# Altium project Dragonfleye.PrjPcb
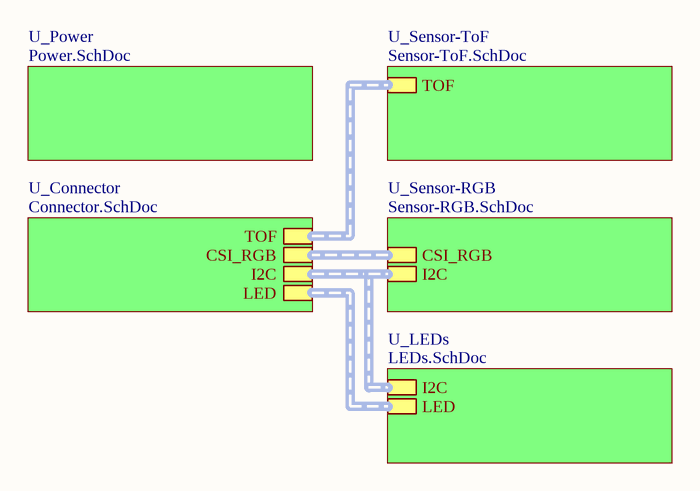
[diagram p0: Dragonfleye.SchDoc]
6 sheets, 63 parts. Net scope: hierarchical (ports join the sheet entries above them; power ports are global).
Board file: Dragonfleye.PcbDoc
Sheets:
  Dragonfleye.SchDoc
    U_Power = Power.SchDoc
    U_LEDs = LEDs.SchDoc
    U_Sensor-ToF = Sensor-ToF.SchDoc
    U_Connector = Connector.SchDoc
    U_Sensor-RGB = Sensor-RGB.SchDoc

## Sheet Dragonfleye.SchDoc
size A; DocumentNumber: 1; SheetNumber: 1

### Sub-sheets
U_Connector = Connector.SchDoc: I2C (harness I2C), TOF (harness TOF), LED (harness LED), CSI_RGB (harness CSI)
U_LEDs = LEDs.SchDoc: LED (harness LED), I2C (harness I2C)
U_Power = Power.SchDoc: no entries
U_Sensor-RGB = Sensor-RGB.SchDoc: CSI_RGB (harness CSI), I2C (harness I2C)
U_Sensor-ToF = Sensor-ToF.SchDoc: TOF (harness TOF)

### Buses and harness runs
harness sheet U_Connector/CSI_RGB = sheet U_Sensor-RGB/CSI_RGB
harness sheet U_Connector/I2C = sheet U_LEDs/I2C = sheet U_Sensor-RGB/I2C
harness sheet U_Connector/LED = sheet U_LEDs/LED
harness sheet U_Connector/TOF = sheet U_Sensor-ToF/TOF

## Sheet Power.SchDoc
size A
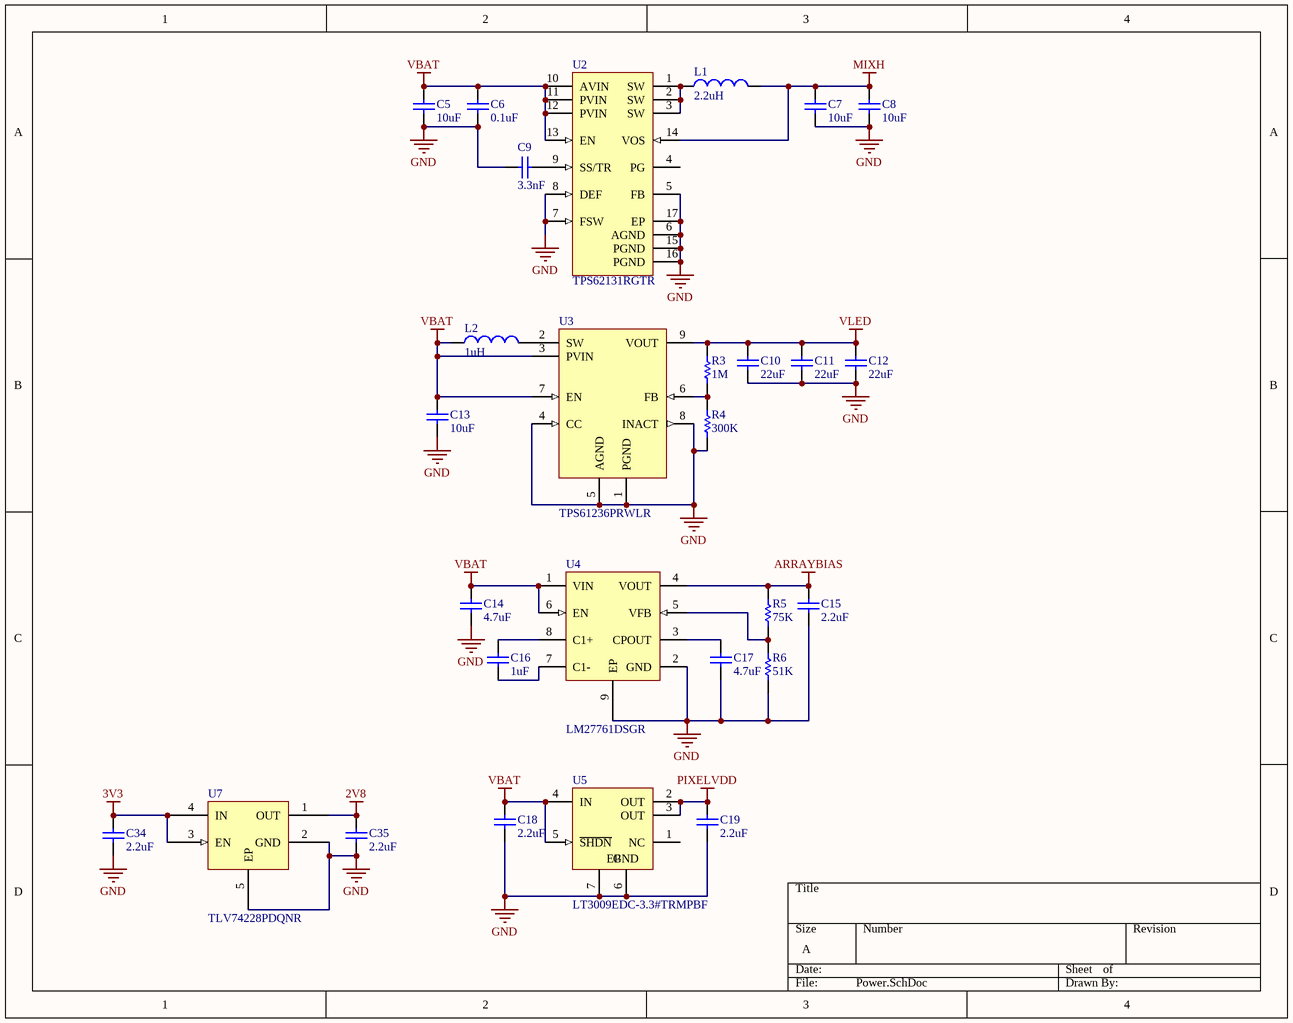
[diagram p1: Power.SchDoc]

### Parts
C5  value 10uF  [C0402[1005X55]]  (hidden comment: 10uF 6.3V 0402)
C6  value 0.1uF  [C0201[0603X30]]  (hidden comment: 0.1uF 6.3V 0201)
C7  value 10uF  [C0402[1005X55]]  (hidden comment: 10uF 6.3V 0402)
C8  value 10uF  [C0402[1005X55]]  (hidden comment: 10uF 6.3V 0402)
C9  value 3.3nF  [C0201[0603X30]]  (hidden comment: 3.3nF 6.3V 0201)
C10  value 22uF  [C0603[1608X92]]  (hidden comment: 22uF 6.3V 0603)
C11  value 22uF  [C0603[1608X92]]  (hidden comment: 22uF 6.3V 0603)
C12  value 22uF  [C0603[1608X92]]  (hidden comment: 22uF 6.3V 0603)
C13  value 10uF  [C0402[1005X55]]  (hidden comment: 10uF 6.3V 0402)
C14  value 4.7uF  [C0402[1005X55]]  (hidden comment: 4.7uF 6.3V 0402)
C15  value 2.2uF  [C0402[1005X55]]  (hidden comment: 2.2uF 6.3V 0402)
C16  value 1uF  [C0402[1005X55]]  (hidden comment: 1uF 6.3V 0402)
C17  value 4.7uF  [C0402[1005X55]]  (hidden comment: 4.7uF 6.3V 0402)
C18  value 2.2uF  [C0402[1005X55]]  (hidden comment: 2.2uF 6.3V 0402)
C19  value 2.2uF  [C0402[1005X55]]  (hidden comment: 2.2uF 6.3V 0402)
C34  value 2.2uF  [C0402[1005X55]]  (hidden comment: 2.2uF 6.3V 0402)
C35  value 2.2uF  [C0402[1005X55]]  (hidden comment: 2.2uF 6.3V 0402)
L1  2.2uH  [IND1008]
L2  1uH  [IND1008]
R3  value 1M  [R0402[1005]]  (hidden comment: 1M 1% 0402)
R4  value 300K  [R0402[1005]]  (hidden comment: 300K 1% 0402)
R5  value 75K  [R0402[1005]]  (hidden comment: 75K 1% 0402)
R6  value 51K  [R0402[1005]]  (hidden comment: 51K 1% 0402)
U2  TPS62131RGTR  [RGT0016C_V]
U3  TPS61236PRWLR  [VQFN-9]
U4  LM27761DSGR  [WSON-8]
U5  LT3009EDC-3.3#TRMPBF  [LT-DC6-6_V]
U7  TLV74228PDQNR  [X2SON-4]

### Nets
2V8: C35.2 U7.1(OUT)
3V3: C34.2 U7.3(EN) U7.4(IN)
ARRAYBIAS: C15.2 R5.2 U4.4(VOUT)
GND: C5.1 C6.1 C7.1 C8.1 C9.1 C10.1 C11.1 C12.1 C13.1 C14.1 C15.1 C17.1 C18.1 C19.1 C34.1 C35.1 R4.1 R6.1 U2.5(FB) U2.6(AGND) U2.7(FSW) U2.8(DEF) U2.15(PGND) U2.16(PGND) U2.17(EP) U3.1(PGND) U3.4(CC) U3.5(AGND) U3.8(INACT) U4.2(GND) U4.9(EP) U5.6(GND) U5.7(EP) U7.2(GND) U7.5(EP)
MIXH: C7.2 C8.2 L1.2 U2.14(VOS)
PIXELVDD: C19.2 U5.2(OUT) U5.3(OUT)
VBAT: C5.2 C6.2 C13.2 C14.2 C18.2 L2.1 U2.10(AVIN) U2.11(PVIN) U2.12(PVIN) U2.13(EN) U3.3(PVIN) U3.7(EN) U4.1(VIN) U4.6(EN) U5.4(IN) U5.5(~{SHDN})
VLED: C10.2 C11.2 C12.2 R3.2 U3.9(VOUT)
NetC9_2: C9.2 U2.9(SS/TR)
NetC16_1: C16.1 U4.7(C1-)
NetC16_2: C16.2 U4.8(C1+)
NetC17_2: C17.2 U4.3(CPOUT)
NetL1_1: L1.1 U2.1(SW) U2.2(SW) U2.3(SW)
NetL2_2: L2.2 U3.2(SW)
NetR3_1: R3.1 R4.2 U3.6(FB)
NetR5_1: R5.1 R6.2 U4.5(VFB)

Not connected (* = marked no-connect by the designer): U2 4(PG); U5 1(NC)

### Library data of the parts
C5 C7 C8 C13 = CAP_10uF_6.3V_0402_20%: 10uF 6.3V 20% 0402 (1005 Metric); PartNumber: GRM155R60J106ME44D; Manufacturer: Murata; Mounting Technology: Surface Mount; PackageReference: 0402; PackageDescription: 0402 (1005 Metric); Voltage: 6.3V; Tolerance: 20%
C6 = CAP_0.1uF_6.3V_0201_10%: 0.1uF 6.3V 10% 0201 (0603 Metric); PartNumber: GRT033R60J104KE01D; Manufacturer: Murata; Mounting Technology: Surface Mount; PackageReference: 0201; PackageDescription: 0201 (0603 Metric); Voltage: 6.3V; Tolerance: 10%
C9 = CAP_3,3nF_6.3V_0201_10%: 3.3nF 6.3V 10% 0201 (0603 Metric); PartNumber: GRM033R70J332KA01D; Manufacturer: Murata; Mounting Technology: Surface Mount; PackageReference: 0201; PackageDescription: 0201 (0603 Metric); Voltage: 6.3V; Tolerance: 10%
C10-C12 = CAP_22uF_6.3V_0603_10%: 22uF 6.3V 10% 0603 (1608 Metric); PartNumber: GRT188R60J226ME13D; Manufacturer: Murata; Mounting Technology: Surface Mount; PackageReference: 0603; PackageDescription: 0603 (1608 Metric); Voltage: 6.3V; Tolerance: 10%
C14 C17 = CAP_4.7uF_6.3V_0402_20%: 4.7uF 6.3V 20% 0402 (1005 Metric); PartNumber: GRM155R60J475ME47D; Manufacturer: Murata; Mounting Technology: Surface Mount; PackageReference: 0402; PackageDescription: 0402 (1005 Metric); Voltage: 6.3V; Tolerance: 20%
C15 C18 C19 C34 C35 = CAP_2.2uF_6.3V_0402_20%: 2.2uF 6.3V 20% 0402 (1005 Metric); PartNumber: GRM155R60J225ME15D; Manufacturer: Murata; Mounting Technology: Surface Mount; PackageReference: 0402; PackageDescription: 0402 (1005 Metric); Voltage: 6.3V; Tolerance: 20%
C16 = CAP_1uF_6.3V_0402_10%: 1uF 6.3V 10% 0402 (1005 Metric); PartNumber: GRM155R70J105KA12D; Manufacturer: Murata; Mounting Technology: Surface Mount; PackageReference: 0402; PackageDescription: 0402 (1005 Metric); Voltage: 6.3V; Tolerance: 10%
L1 = IND_2.2uH_3.3A_1008_20%: 2.2uH 20% 3.3A 1008; PartNumber: DFE252012F-2R2M=P2; Manufacturer: Murata; PackageReference: 1008; PackageDescription: 1008 (2520 metric); Mounting Technology: Surface Mount; Current: 3.3A; Value: 2.2uH
L2 = IND_1uH_4.7A_1008_20%: 1uH 20% 4.7A 1008; PartNumber: DFE252012F-2R2M=P2; Manufacturer: Murata; PackageReference: 1008; PackageDescription: 1008 (2520 metric); Mounting Technology: Surface Mount; Current: 4.7A; Value: 1uH
R3 = RES_1M_0402_1%: 1M 0.063W 1% 0402 (1005 Metric); Manufacturer: KOA Speer; PartNumber: RK73H1ETTP1004F; Tolerance: 1%; Power: 0.063W; Mounting Technology: Surface Mount; PackageReference: 0402; PackageDescription: 0402 (1005 Metric); ComponentLink1Description: Datasheet; ComponentLink1URL: http://www.koaspeer.com/catimages/Products/RK73H/RK73H.pdf
R4 = RES_300K_0402_1%: 300K 0.063W 1% 0402 (1005 Metric); Manufacturer: KOA Speer; PartNumber: RK73H1ETTP3003F; Tolerance: 1%; Power: 0.063W; Mounting Technology: Surface Mount; PackageReference: 0402; PackageDescription: 0402 (1005 Metric); ComponentLink1Description: Datasheet; ComponentLink1URL: http://www.koaspeer.com/catimages/Products/RK73H/RK73H.pdf
R5 = RES_75K_0402_1%: 75K 0.063W 1% 0402 (1005 Metric); Manufacturer: KOA Speer; PartNumber: RK73H1ETTP7502F; Tolerance: 1%; Power: 0.063W; Mounting Technology: Surface Mount; PackageReference: 0402; PackageDescription: 0402 (1005 Metric); ComponentLink1Description: Datasheet; ComponentLink1URL: http://www.koaspeer.com/catimages/Products/RK73H/RK73H.pdf
R6 = RES_51K_0402_1%: 51K 0.063W 1% 0402 (1005 Metric); Manufacturer: KOA Speer; PartNumber: RK73H1ETTP5102F; Tolerance: 1%; Power: 0.063W; Mounting Technology: Surface Mount; PackageReference: 0402; PackageDescription: 0402 (1005 Metric); ComponentLink1Description: Datasheet; ComponentLink1URL: http://www.koaspeer.com/catimages/Products/RK73H/RK73H.pdf
U2 = CMP-0323-00113-2: Buck Step Down Regulator with 3 to 17 V Input and 1.8 V Output, -40 to 85 degC, 16-Pin QFN (RGT), Green (RoHS & no Sb/Br); Manufacturer: Texas Instruments; Duty Cycle(Max)(%): 100; Vin(Max)(V): 17; Switch Current Limit(Typ)(A): 4.2; Iq(Typ)(mA): 0.017; Preset Vout(V): 1.8; Synchronous Rectification: TRUE; SubFamily: Step-Down Regulator; Regulated Outputs(#): 1; Vin(Min)(V): 3; Rating: Catalog; DatasheetVersion: SLVSAG7; ComponentLink2URL: Samples URL:http://www.ti.com/product/tps62131#samples; Topology: Buck; PackageVersion: revH, Oct-2011; Vout(Max)(V): 1.8; PackageDescription: 16-Pin Plastic Quad Flat No-Lead, 3 x 3 mm Body, 0.5 mm Pitch, 1.7 x 1.7 mm Exposed Pad; ComponentLink2Description: URL Link1; Vout(Min)(V): 1.8; Eco-Plan: Green (RoHS & no Sb/Br); ComponentLink1Description: Datasheet; ComponentLink1URL: http://www.ti.com/general/docs/lit/getliterature.tsp?genericPartNumber=TPS62131&fileType=pdf; PackageReference: RGT0016C; PartNumber: TPS62131RGTR; Iout(Max)(A): 3; Code_JEDEC: MO-220; Mounting Technology: Surface Mount
U3 = TPS61236PRWLR: Manufacturer: Texas Instruments; PartNumber: TPS61236PRWLR; PackageReference: VQFN-9; Mounting Technology: Surface Mount
U4 = LM27761DSGR: Switching Voltage Regulators Switch Cap Boost; Manufacturer: Texas Instruments; PartNumber: LM27761DSGR; Mounting Technology: Surface Mount; PackageReference: WSON-8
U5 = CMP-0476-00025-3: 3 uA IQ, 20 mA Low Dropout Linear Regulator, 1.6 to 20 V Vin, 3.3 V Vout, 6-pin SON (DC6-6), -40 to 125 degC, Pb-Free, Mini Tape and Reel; Manufacturer: Linear Technology; Vin Max(V): 20; Isupply(mA): 0.003; Discrete Pass Element: no; Vin Min(V): 1.6; Output Voltage: 3.3 V; Dropout Voltage(V): 0.28; PSRR(dB): 61; Number of Outputs: 1; Noise(uV): 150; PackageReference: DC6-6; PackageVersion: Rev. B, 06/2010; ComponentLink3URL: http://cds.linear.com/docs/en/packaging/DFN_6_05-08-1703.pdf; Code_JEDEC: MO-229; Mounting Technology: Surface Mount; ComponentLink2URL: http://cds.linear.com/docs/en/datasheet/3009fd.pdf; Iout(mA): 20; ComponentLink3Description: Package Specification; Packing: Mini Tape and Reel; ComponentLink1URL: http://www.linear.com/; RoHS: TRUE; DatasheetVersion: Rev. D; ComponentLink1Description: Manufacturer URL; PartNumber: LT3009EDC-3.3#TRMPBF; Shutdown Current(uA): 1; PackageDescription: 6-Pin Plastic DFN, Body 2 x 2 mm, Pitch 0.5 mm; ComponentLink2Description: Datasheet
U7 = TLV74228PDQNR: LDO Voltage Regulators 200mA Small-Size Low-Dropout (LDO) Linear Voltage Regulator 4-X2SON -40 to 125; Manufacturer: Texas Instruments; PartNumber: TLV74218PDQNR; PackageReference: X2SON-4; Mounting Technology: Surface Mount

## Sheet LEDs.SchDoc
size A
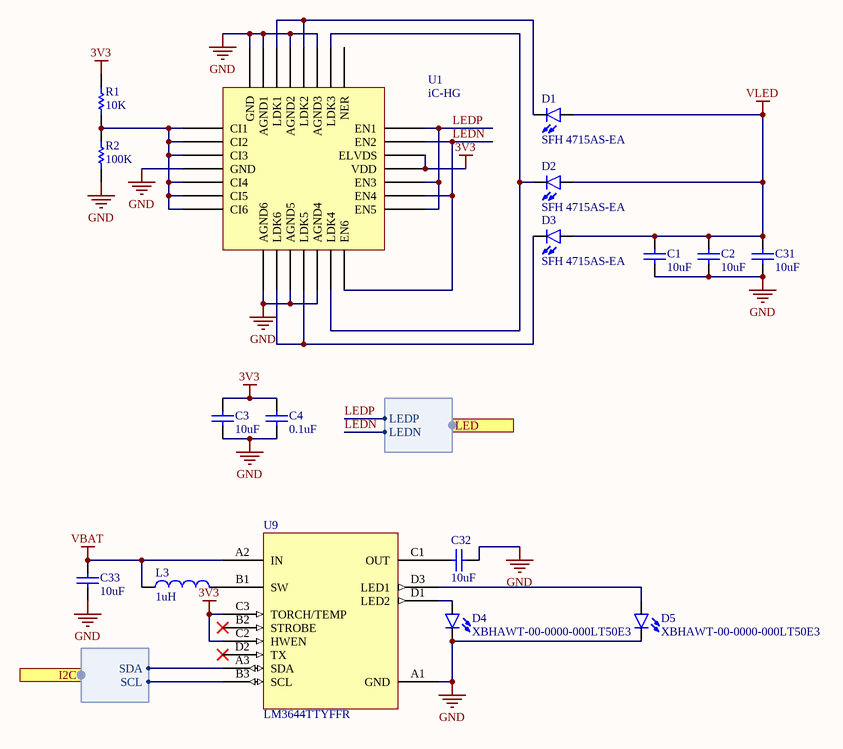
[diagram p2: LEDs.SchDoc]

### Parts
C1  value 10uF  [C0402[1005X55]]  (hidden comment: 10uF 6.3V 0402)
C2  value 10uF  [C0402[1005X55]]  (hidden comment: 10uF 6.3V 0402)
C3  value 10uF  [C0402[1005X55]]  (hidden comment: 10uF 6.3V 0402)
C4  value 0.1uF  [C0201[0603X30]]  (hidden comment: 0.1uF 6.3V 0201)
C31  value 10uF  [C0402[1005X55]]  (hidden comment: 10uF 6.3V 0402)
C32  value 10uF  [C0402[1005X55]]  (hidden comment: 10uF 6.3V 0402)
C33  value 10uF  [C0402[1005X55]]  (hidden comment: 10uF 6.3V 0402)
D1  SFH 4715AS-EA  [SFH 4715AS]
D2  SFH 4715AS-EA  [SFH 4715AS]
D3  SFH 4715AS-EA  [SFH 4715AS]
D4  XBHAWT-00-0000-000LT50E3  [XBHAWT]
D5  XBHAWT-00-0000-000LT50E3  [XBHAWT]
L3  1uH  [IND0402]
R1  value 10K  [R0402[1005]]  (hidden comment: 10K 1% 0402)
R2  value 100K  [R0402[1005]]  (hidden comment: 100K 1% 0402)
U1  iC-HG  [QFN-28]
U9  LM3644TTYFFR  [BGA-12]

### Ports
I2C (harness I2C), LED (harness LED)

### Harnesses
LED: LEDP, LEDN
I2C: SCL, SDA

### Nets
3V3: C3.2 C4.2 R1.2 U1.18(VDD) U1.19(ELVDS) U9.C2(HWEN) U9.C3(TORCH/TEMP)
GND: C1.1 C2.1 C3.1 C4.1 C31.1 C32.1 C33.1 D4.C D5.C R2.1 U1.4(GND) U1.8(AGND6) U1.10(AGND5) U1.12(AGND4) U1.24(AGND3) U1.26(AGND2) U1.28(AGND1) U1.29(GND) U9.A1(GND)
VBAT: C33.2 L3.1 U9.A2(IN)
VLED: C1.2 C2.2 C31.2 D1.A D2.A D3.A
I2C_SCL: U9.B3(SCL) ; port I2C.SCL
I2C_SDA: U9.A3(SDA) ; port I2C.SDA
LEDN: U1.14(EN6) U1.16(EN4) U1.20(EN2) ; port LED.LEDN
LEDP: U1.15(EN5) U1.17(EN3) U1.21(EN1) ; port LED.LEDP
NetC32_2: C32.2 U9.C1(OUT)
NetD1_C: D1.C U1.25(LDK2) U1.27(LDK1)
NetD2_C: D2.C U1.13(LDK4) U1.23(LDK3)
NetD3_C: D3.C U1.9(LDK6) U1.11(LDK5)
NetD4_A: D4.A U9.D1(LED2)
NetD5_A: D5.A U9.D3(LED1)
NetL3_2: L3.2 U9.B1(SW)
NetR1_1: R1.1 R2.2 U1.1(CI1) U1.2(CI2) U1.3(CI3) U1.5(CI4) U1.6(CI5) U1.7(CI6)

Not connected (* = marked no-connect by the designer): U1 22(NER); U9 B2(STROBE)* D2(TX)*

### Library data of the parts
C1-C3 C31-C33 = CAP_10uF_6.3V_0402_20%: as C5 on sheet Power; Mounting Technology: Surface Mount; PackageReference: 0402; PackageDescription: 0402 (1005 Metric); Voltage: 6.3V; Tolerance: 20%
C4 = CAP_0.1uF_6.3V_0201_10%: as C6 on sheet Power; Mounting Technology: Surface Mount; PackageReference: 0201; PackageDescription: 0201 (0603 Metric); Voltage: 6.3V; Tolerance: 10%
D1-D3 = SFH 4715AS-EA: Manufacturer: Osram; PartNumber: SFH 4715AS-EA; Mounting Technology: Surface Mount; Package Reference: SMD-3
D4 D5 = XBHAWT-00-0000-000LT50E3: Manufacturer: Cree, Inc.; PartNumber: XBHAWT-00-0000-000LT50E3; PackageReference: SMD-2; Mounting Technology: Surface Mount
L3 = IND_1uH_0.5A_0402_20%: 1uH 20% 0.5A 0402; PartNumber: MLP1005M1R0DT0S1; Manufacturer: Murata; PackageReference: 0402; PackageDescription: 0402 (2012 metric); Mounting Technology: Surface Mount; Current: 0.5A; Value: 1uH
R1 = RES_10K_0402_1%: 10K 0.063W 1% 0402 (1005 Metric); Manufacturer: KOA Speer; PartNumber: RK73H1ETTP1002F; Tolerance: 1%; Power: 0.063W; Mounting Technology: Surface Mount; PackageReference: 0402; PackageDescription: 0402 (1005 Metric); ComponentLink1Description: Datasheet; ComponentLink1URL: http://www.koaspeer.com/catimages/Products/RK73H/RK73H.pdf
R2 = RES_100K_0402_1%: 100K 0.063W 1% 0402 (1005 Metric); Manufacturer: KOA Speer; PartNumber: RK73H1ETTP1003F; Tolerance: 1%; Power: 0.063W; Mounting Technology: Surface Mount; PackageReference: 0402; PackageDescription: 0402 (1005 Metric); ComponentLink1Description: Datasheet; ComponentLink1URL: http://www.koaspeer.com/catimages/Products/RK73H/RK73H.pdf
U1 = iC-HG QFN28-5x5: Manufacturer: iC-Haus; PartNumber: iC-HG QFN28-5x5; Mounting Technology: Surface Mount; PackageReference: QFN-28
U9 = LM3644TTYFFR: LED Lighting Drivers 1.5 Amp LED driver; Manufacturer: Texas Instruments; PackageReference: BGA-12; Mounting Technology: Surface Mount; PartNumber: LM3644TTYFFR

## Sheet Sensor-ToF.SchDoc
size A
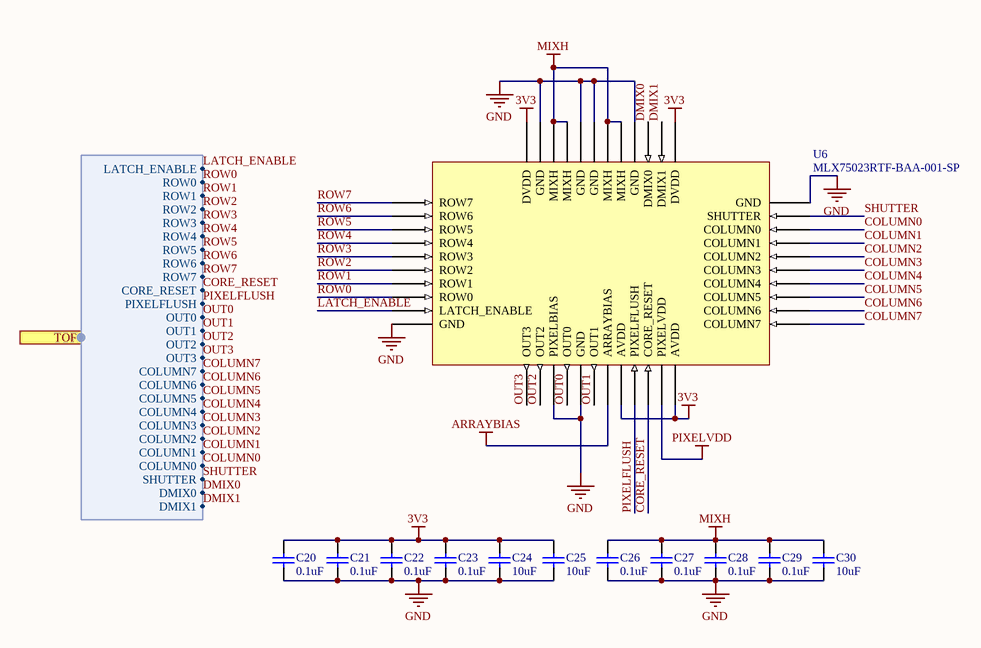
[diagram p3: Sensor-ToF.SchDoc]

### Parts
C20  value 0.1uF  [C0201[0603X30]]  (hidden comment: 0.1uF 6.3V 0201)
C21  value 0.1uF  [C0201[0603X30]]  (hidden comment: 0.1uF 6.3V 0201)
C22  value 0.1uF  [C0201[0603X30]]  (hidden comment: 0.1uF 6.3V 0201)
C23  value 0.1uF  [C0201[0603X30]]  (hidden comment: 0.1uF 6.3V 0201)
C24  value 10uF  [C0402[1005X55]]  (hidden comment: 10uF 6.3V 0402)
C25  value 10uF  [C0402[1005X55]]  (hidden comment: 10uF 6.3V 0402)
C26  value 0.1uF  [C0201[0603X30]]  (hidden comment: 0.1uF 6.3V 0201)
C27  value 0.1uF  [C0201[0603X30]]  (hidden comment: 0.1uF 6.3V 0201)
C28  value 0.1uF  [C0201[0603X30]]  (hidden comment: 0.1uF 6.3V 0201)
C29  value 0.1uF  [C0201[0603X30]]  (hidden comment: 0.1uF 6.3V 0201)
C30  value 10uF  [C0402[1005X55]]  (hidden comment: 10uF 6.3V 0402)
U6  MLX75023RTF-BAA-001-SP  [BGA-44]

### Ports
TOF (harness TOF)

### Harnesses
TOF: DMIX1, DMIX0, SHUTTER, COLUMN0, COLUMN1, COLUMN2, COLUMN4, COLUMN3, COLUMN5, COLUMN6, COLUMN7, LATCH_ENABLE, ROW0, ROW1, ROW2, ROW3, ROW4, ROW5, ROW6, ROW7, CORE_RESET, PIXELFLUSH, OUT0, OUT1, OUT2, OUT3

### Nets
3V3: C20.2 C21.2 C22.2 C23.2 C24.2 C25.2 U6.18(AVDD) U6.22(AVDD) U6.33(DVDD) U6.44(DVDD)
ARRAYBIAS: U6.17(ARRAYBIAS)
GND: C20.1 C21.1 C22.1 C23.1 C24.1 C25.1 C26.1 C27.1 C28.1 C29.1 C30.1 U6.10(GND) U6.13(PIXELBIAS) U6.15(GND) U6.32(GND) U6.36(GND) U6.39(GND) U6.40(GND) U6.43(GND)
MIXH: C26.2 C27.2 C28.2 C29.2 C30.2 U6.37(MIXH) U6.38(MIXH) U6.41(MIXH) U6.42(MIXH)
PIXELVDD: U6.21(PIXELVDD)
COLUMN0: U6.30(COLUMN0) ; port TOF.COLUMN0
COLUMN1: U6.29(COLUMN1) ; port TOF.COLUMN1
COLUMN2: U6.28(COLUMN2) ; port TOF.COLUMN2
COLUMN3: U6.27(COLUMN3) ; port TOF.COLUMN3
COLUMN4: U6.26(COLUMN4) ; port TOF.COLUMN4
COLUMN5: U6.25(COLUMN5) ; port TOF.COLUMN5
COLUMN6: U6.24(COLUMN6) ; port TOF.COLUMN6
COLUMN7: U6.23(COLUMN7) ; port TOF.COLUMN7
CORE_RESET: U6.20(CORE_RESET) ; port TOF.CORE_RESET
DMIX0: U6.35(DMIX0) ; port TOF.DMIX0
DMIX1: U6.34(DMIX1) ; port TOF.DMIX1
LATCH_ENABLE: U6.9(LATCH_ENABLE) ; port TOF.LATCH_ENABLE
OUT0: U6.14(OUT0) ; port TOF.OUT0
OUT1: U6.16(OUT1) ; port TOF.OUT1
OUT2: U6.12(OUT2) ; port TOF.OUT2
OUT3: U6.11(OUT3) ; port TOF.OUT3
PIXELFLUSH: U6.19(PIXELFLUSH) ; port TOF.PIXELFLUSH
ROW0: U6.8(ROW0) ; port TOF.ROW0
ROW1: U6.7(ROW1) ; port TOF.ROW1
ROW2: U6.6(ROW2) ; port TOF.ROW2
ROW3: U6.5(ROW3) ; port TOF.ROW3
ROW4: U6.4(ROW4) ; port TOF.ROW4
ROW5: U6.3(ROW5) ; port TOF.ROW5
ROW6: U6.2(ROW6) ; port TOF.ROW6
ROW7: U6.1(ROW7) ; port TOF.ROW7
SHUTTER: U6.31(SHUTTER) ; port TOF.SHUTTER

### Library data of the parts
C20-C23 C26-C29 = CAP_0.1uF_6.3V_0201_10%: as C6 on sheet Power; Mounting Technology: Surface Mount; PackageReference: 0201; PackageDescription: 0201 (0603 Metric); Voltage: 6.3V; Tolerance: 10%
C24 C25 C30 = CAP_10uF_6.3V_0402_20%: as C5 on sheet Power; Mounting Technology: Surface Mount; PackageReference: 0402; PackageDescription: 0402 (1005 Metric); Voltage: 6.3V; Tolerance: 20%
U6 = MLX75023RTF-BAA-001-SP: Manufacturer: Melexis; PartNumber: MLX75023RTF-BAA-001-SP; Mounting Technology: Surface Mount; PackageReference: BGA-44

## Sheet Connector.SchDoc
size A; DocumentNumber: 6; SheetNumber: 6
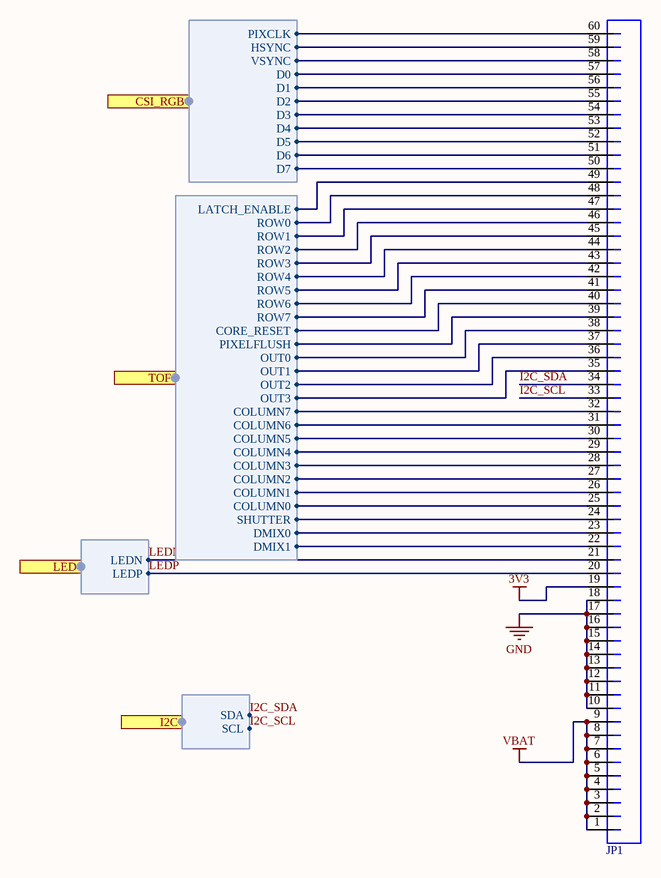
[diagram p4: Connector.SchDoc]

### Parts
JP1  JST_JMD_60_RECEPTACLE  [JST-JMD-60-SMD-RECEPTACLE]  (value not drawn)

### Ports
CSI_RGB (harness CSI), I2C (harness I2C), LED (harness LED), TOF (harness TOF)

### Harnesses
CSI: D2, D3, D1, D0, D6, D7, D5, D4, PIXCLK, HSYNC, VSYNC
LED: LEDP, LEDN
I2C: SCL, SDA
TOF: DMIX1, DMIX0, SHUTTER, COLUMN0, COLUMN1, COLUMN2, COLUMN4, COLUMN3, COLUMN5, COLUMN6, COLUMN7, LATCH_ENABLE, ROW0, ROW1, ROW2, ROW3, ROW4, ROW5, ROW6, ROW7, CORE_RESET, PIXELFLUSH, OUT0, OUT1, OUT2, OUT3

### Nets
3V3: JP1.19
GND: JP1.10 JP1.11 JP1.12 JP1.13 JP1.14 JP1.15 JP1.16 JP1.17 JP1.18
VBAT: JP1.1 JP1.2 JP1.3 JP1.4 JP1.5 JP1.6 JP1.7 JP1.8 JP1.9
COLUMN0: JP1.25 ; port TOF.COLUMN0
COLUMN1: JP1.26 ; port TOF.COLUMN1
COLUMN2: JP1.27 ; port TOF.COLUMN2
COLUMN3: JP1.28 ; port TOF.COLUMN3
COLUMN4: JP1.29 ; port TOF.COLUMN4
COLUMN5: JP1.30 ; port TOF.COLUMN5
COLUMN6: JP1.31 ; port TOF.COLUMN6
COLUMN7: JP1.32 ; port TOF.COLUMN7
CORE_RESET: JP1.40 ; port TOF.CORE_RESET
DMIX0: JP1.23 ; port TOF.DMIX0
DMIX1: JP1.22 ; port TOF.DMIX1
HREF: JP1.59 ; port CSI_RGB.HSYNC
I2C_SCL: JP1.33 ; port I2C.SCL
I2C_SDA: JP1.34 ; port I2C.SDA
LATCH_ENABLE: JP1.49 ; port TOF.LATCH_ENABLE
LEDN: JP1.21 ; port LED.LEDN
LEDP: JP1.20 ; port LED.LEDP
OUT0: JP1.38 ; port TOF.OUT0
OUT1: JP1.37 ; port TOF.OUT1
OUT2: JP1.36 ; port TOF.OUT2
OUT3: JP1.35 ; port TOF.OUT3
PCLK: JP1.60 ; port CSI_RGB.PIXCLK
PIXELFLUSH: JP1.39 ; port TOF.PIXELFLUSH
ROW0: JP1.48 ; port TOF.ROW0
ROW1: JP1.47 ; port TOF.ROW1
ROW2: JP1.46 ; port TOF.ROW2
ROW3: JP1.45 ; port TOF.ROW3
ROW4: JP1.44 ; port TOF.ROW4
ROW5: JP1.43 ; port TOF.ROW5
ROW6: JP1.42 ; port TOF.ROW6
ROW7: JP1.41 ; port TOF.ROW7
SHUTTER: JP1.24 ; port TOF.SHUTTER
VSYNC: JP1.58 ; port CSI_RGB.VSYNC
NetJP1_50: JP1.50 ; port CSI_RGB.D7
NetJP1_51: JP1.51 ; port CSI_RGB.D6
NetJP1_52: JP1.52 ; port CSI_RGB.D5
NetJP1_53: JP1.53 ; port CSI_RGB.D4
NetJP1_54: JP1.54 ; port CSI_RGB.D3
NetJP1_55: JP1.55 ; port CSI_RGB.D2
NetJP1_56: JP1.56 ; port CSI_RGB.D1
NetJP1_57: JP1.57 ; port CSI_RGB.D0

### Library data of the parts
JP1 = JST_JMD_60_RECEPTACLE: Manufacturer: JST Sales America, Inc.; PartNumber: 60R-JMDSS-G-1-TF(S); PackageReference: JMD-60; Mounting Technology: Surface Mount

## Sheet Sensor-RGB.SchDoc
size A; DocumentNumber: 4; SheetNumber: 4
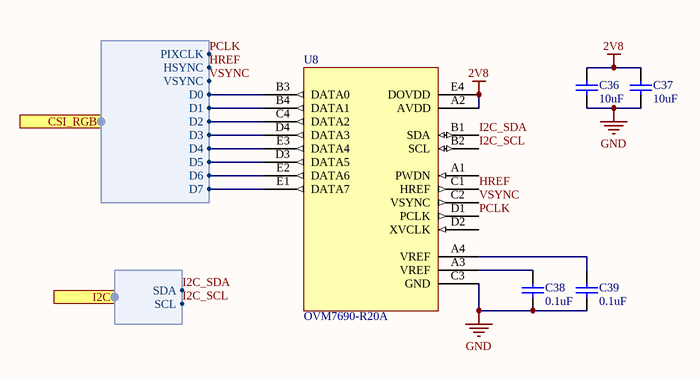
[diagram p5: Sensor-RGB.SchDoc]

### Parts
C36  value 10uF  [C0402[1005X55]]  (hidden comment: 10uF 6.3V 0402)
C37  value 10uF  [C0402[1005X55]]  (hidden comment: 10uF 6.3V 0402)
C38  value 0.1uF  [C0201[0603X30]]  (hidden comment: 0.1uF 6.3V 0201)
C39  value 0.1uF  [C0201[0603X30]]  (hidden comment: 0.1uF 6.3V 0201)
U8  OVM7690-R20A

### Ports
CSI_RGB (harness CSI), I2C (harness I2C)

### Harnesses
CSI: D2, D3, D1, D0, D6, D7, D5, D4, PIXCLK, HSYNC, VSYNC
I2C: SCL, SDA

### Nets
2V8: C36.2 C37.2 U8.A2(AVDD) U8.E4(DOVDD)
GND: C36.1 C37.1 C38.1 C39.1 U8.C3(GND)
HREF: U8.C1(HREF) ; port CSI_RGB.HSYNC
I2C_SCL: U8.B2(SCL) ; port I2C.SCL
I2C_SDA: U8.B1(SDA) ; port I2C.SDA
PCLK: U8.D1(PCLK) ; port CSI_RGB.PIXCLK
VSYNC: U8.C2(VSYNC) ; port CSI_RGB.VSYNC
NetC38_2: C38.2 U8.A3(VREF)
NetC39_2: C39.2 U8.A4(VREF)
NetJP1_50: U8.E1(DATA7) ; port CSI_RGB.D7
NetJP1_51: U8.E2(DATA6) ; port CSI_RGB.D6
NetJP1_52: U8.D3(DATA5) ; port CSI_RGB.D5
NetJP1_53: U8.E3(DATA4) ; port CSI_RGB.D4
NetJP1_54: U8.D4(DATA3) ; port CSI_RGB.D3
NetJP1_55: U8.C4(DATA2) ; port CSI_RGB.D2
NetJP1_56: U8.B4(DATA1) ; port CSI_RGB.D1
NetJP1_57: U8.B3(DATA0) ; port CSI_RGB.D0

Not connected (* = marked no-connect by the designer): U8 A1(PWDN) D2(XVCLK)

### Library data of the parts
C36 C37 = CAP_10uF_6.3V_0402_20%: as C5 on sheet Power; Mounting Technology: Surface Mount; PackageReference: 0402; PackageDescription: 0402 (1005 Metric); Voltage: 6.3V; Tolerance: 20%
C38 C39 = CAP_0.1uF_6.3V_0201_10%: as C6 on sheet Power; Mounting Technology: Surface Mount; PackageReference: 0201; PackageDescription: 0201 (0603 Metric); Voltage: 6.3V; Tolerance: 10%
U8 = OVM7690-R20A: SENSOR CAMERA CMOS 20CAMERACUBE; Manufacturer: OmniVision Technologies; PartNumber: OVM7690-R20A; PackageReference: 20-CAMERACUBE; Mounting Technology: Surface Mount

## Nets that join several sheets
2V8: Power (C35.2 U7.1), Sensor-RGB (C36.2 C37.2 U8.A2 U8.E4)
3V3: Power (C34.2 U7.3 U7.4), LEDs (7 pins), Sensor-ToF (10 pins), Connector (JP1.19)
ARRAYBIAS: Power (C15.2 R5.2 U4.4), Sensor-ToF (U6.17)
GND: Power (35 pins), LEDs (19 pins), Sensor-ToF (19 pins), Connector (9 pins), Sensor-RGB (5 pins)
MIXH: Power (C7.2 C8.2 L1.2 U2.14), Sensor-ToF (9 pins)
PIXELVDD: Power (C19.2 U5.2 U5.3), Sensor-ToF (U6.21)
VBAT: Power (16 pins), LEDs (C33.2 L3.1 U9.A2), Connector (9 pins)
VLED: Power (5 pins), LEDs (6 pins)
COLUMN0: Sensor-ToF (U6.30), Connector (JP1.25)
COLUMN1: Sensor-ToF (U6.29), Connector (JP1.26)
COLUMN2: Sensor-ToF (U6.28), Connector (JP1.27)
COLUMN3: Sensor-ToF (U6.27), Connector (JP1.28)
COLUMN4: Sensor-ToF (U6.26), Connector (JP1.29)
COLUMN5: Sensor-ToF (U6.25), Connector (JP1.30)
COLUMN6: Sensor-ToF (U6.24), Connector (JP1.31)
COLUMN7: Sensor-ToF (U6.23), Connector (JP1.32)
CORE_RESET: Sensor-ToF (U6.20), Connector (JP1.40)
DMIX0: Sensor-ToF (U6.35), Connector (JP1.23)
DMIX1: Sensor-ToF (U6.34), Connector (JP1.22)
HREF: Connector (JP1.59), Sensor-RGB (U8.C1)
I2C_SCL: LEDs (U9.B3), Connector (JP1.33), Sensor-RGB (U8.B2)
I2C_SDA: LEDs (U9.A3), Connector (JP1.34), Sensor-RGB (U8.B1)
LATCH_ENABLE: Sensor-ToF (U6.9), Connector (JP1.49)
LEDN: LEDs (U1.14 U1.16 U1.20), Connector (JP1.21)
LEDP: LEDs (U1.15 U1.17 U1.21), Connector (JP1.20)
NetJP1_50: Connector (JP1.50), Sensor-RGB (U8.E1)
NetJP1_51: Connector (JP1.51), Sensor-RGB (U8.E2)
NetJP1_52: Connector (JP1.52), Sensor-RGB (U8.D3)
NetJP1_53: Connector (JP1.53), Sensor-RGB (U8.E3)
NetJP1_54: Connector (JP1.54), Sensor-RGB (U8.D4)
NetJP1_55: Connector (JP1.55), Sensor-RGB (U8.C4)
NetJP1_56: Connector (JP1.56), Sensor-RGB (U8.B4)
NetJP1_57: Connector (JP1.57), Sensor-RGB (U8.B3)
OUT0: Sensor-ToF (U6.14), Connector (JP1.38)
OUT1: Sensor-ToF (U6.16), Connector (JP1.37)
OUT2: Sensor-ToF (U6.12), Connector (JP1.36)
OUT3: Sensor-ToF (U6.11), Connector (JP1.35)
PCLK: Connector (JP1.60), Sensor-RGB (U8.D1)
PIXELFLUSH: Sensor-ToF (U6.19), Connector (JP1.39)
ROW0: Sensor-ToF (U6.8), Connector (JP1.48)
ROW1: Sensor-ToF (U6.7), Connector (JP1.47)
ROW2: Sensor-ToF (U6.6), Connector (JP1.46)
ROW3: Sensor-ToF (U6.5), Connector (JP1.45)
ROW4: Sensor-ToF (U6.4), Connector (JP1.44)
ROW5: Sensor-ToF (U6.3), Connector (JP1.43)
ROW6: Sensor-ToF (U6.2), Connector (JP1.42)
ROW7: Sensor-ToF (U6.1), Connector (JP1.41)
SHUTTER: Sensor-ToF (U6.31), Connector (JP1.24)
VSYNC: Connector (JP1.58), Sensor-RGB (U8.C2)